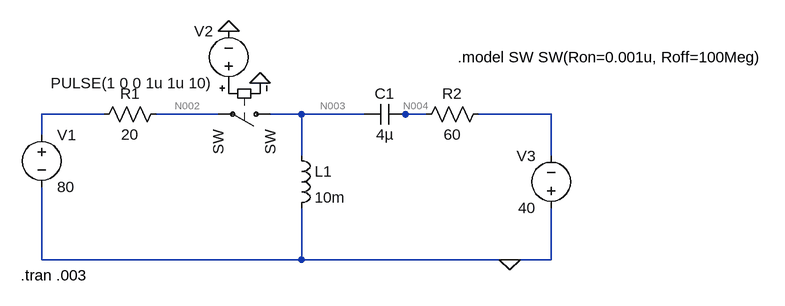
[diagram p0: schematic pas73.asc]
pas73.asc, the LTspice schematic file:
Version 4.1
SHEET 1 1088 680
WIRE 32 80 -64 80
WIRE 208 80 112 80
WIRE 336 80 288 80
WIRE 432 80 336 80
WIRE 496 80 480 80
WIRE 528 80 496 80
WIRE 720 80 608 80
WIRE -64 112 -64 80
WIRE 336 144 336 80
WIRE 720 144 720 80
WIRE -64 304 -64 192
WIRE 336 304 336 224
WIRE 336 304 -64 304
WIRE 656 304 336 304
WIRE 720 304 720 224
WIRE 720 304 656 304
FLAG 656 304 0
FLAG 272 32 0
FLAG 224 -48 0
SYMBOL voltage -64 96 R0
WINDOW 123 0 0 Left 0
WINDOW 39 0 0 Left 0
SYMATTR InstName V1
SYMATTR Value 80
SYMBOL res 128 64 R90
WINDOW 0 0 56 VBottom 2
WINDOW 3 32 56 VTop 2
SYMATTR InstName R1
SYMATTR Value 20
SYMBOL sw 304 80 R90
SYMATTR InstName SW
SYMBOL ind 320 128 R0
SYMATTR InstName L1
SYMATTR Value 10m
SYMATTR SpiceLine Rser=0
SYMBOL cap 496 64 R90
WINDOW 0 0 32 VBottom 2
WINDOW 3 32 32 VTop 2
SYMATTR InstName C1
SYMATTR Value 4µ
SYMATTR SpiceLine Rser=0
SYMBOL voltage 224 48 R180
WINDOW 0 24 96 Left 2
WINDOW 3 24 16 Left 2
WINDOW 123 0 0 Left 0
WINDOW 39 0 0 Left 0
SYMATTR InstName V2
SYMATTR Value PULSE(1 0 0 1u 1u 10)
SYMBOL res 624 64 R90
WINDOW 0 0 56 VBottom 2
WINDOW 3 32 56 VTop 2
SYMATTR InstName R2
SYMATTR Value 60
SYMBOL voltage 720 240 R180
WINDOW 0 24 96 Left 2
WINDOW 3 24 16 Left 2
WINDOW 123 0 0 Left 0
WINDOW 39 0 0 Left 0
SYMATTR InstName V3
SYMATTR Value 40
TEXT 576 -8 Left 2 !.model SW SW(Ron=0.001u, Roff=100Meg)
TEXT -96 328 Left 2 !.tran .003

The netlist it stands for:
* pas73.asc
V1 N001 0 80
R1 N002 N001 20
SW N003 N002 P001 0 SW
L1 N003 0 10m Rser=0
C1 N004 N003 4µ Rser=0
V2 P001 0 PULSE(1 0 0 1u 1u 10)
R2 N005 N004 60
V3 0 N005 40
.model SW SW(Ron=0.001u, Roff=100Meg)
.tran .003
.backanno
.end

* Results of the author's LTspice run, read from the files saved beside the schematic
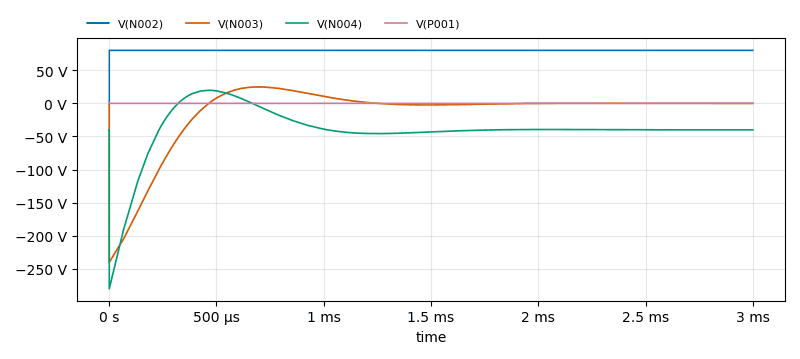
[diagram p1: Transient Analysis of pas73.asc, plotted from the saved traces]
* Transient Analysis, 1 run:
*   V(N002): min 0 V, max 80 V, average 79.97 V, rms 79.99 V, last 80 V
*   V(N003): min -240 V, max 24.82 V, average -13.32 V, rms 52.13 V, last -20.33 mV
*   V(N004): min -280 V, max 19.72 V, average -40.08 V, rms 57.29 V, last -40.04 V
*   V(P001): min 0 V, max 1 V, average 166.7 µV, rms 11.11 mV, last 0 V